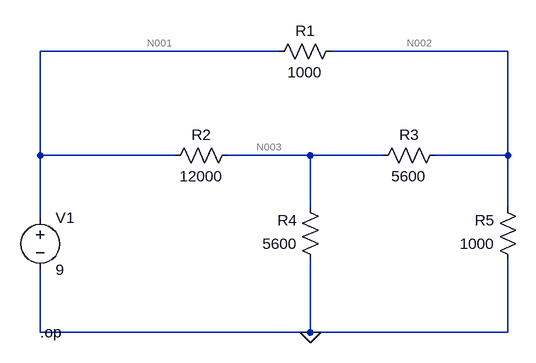
[diagram p0: schematic Circuit 1.asc]
Circuit 1.asc, the LTspice schematic file:
Version 4
SHEET 1 880 680
WIRE 160 80 -208 80
WIRE 512 80 240 80
WIRE -208 240 -208 80
WIRE 0 240 -208 240
WIRE 208 240 80 240
WIRE 320 240 208 240
WIRE 512 240 512 80
WIRE 512 240 400 240
WIRE 208 320 208 240
WIRE 512 320 512 240
WIRE -208 336 -208 240
WIRE -208 512 -208 416
WIRE 208 512 208 400
WIRE 208 512 -208 512
WIRE 512 512 512 400
WIRE 512 512 208 512
FLAG 208 512 0
SYMBOL res 256 64 R90
WINDOW 0 0 56 VBottom 2
WINDOW 3 32 56 VTop 2
SYMATTR InstName R1
SYMATTR Value 1000
SYMBOL res 96 224 R90
WINDOW 0 0 56 VBottom 2
WINDOW 3 32 56 VTop 2
SYMATTR InstName R2
SYMATTR Value 12000
SYMBOL res 224 416 R180
WINDOW 0 36 76 Left 2
WINDOW 3 36 40 Left 2
SYMATTR InstName R4
SYMATTR Value 5600
SYMBOL res 528 416 R180
WINDOW 0 36 76 Left 2
WINDOW 3 36 40 Left 2
SYMATTR InstName R5
SYMATTR Value 1000
SYMBOL voltage -208 320 R0
WINDOW 123 0 0 Left 0
WINDOW 39 0 0 Left 0
SYMATTR InstName V1
SYMATTR Value 9
SYMBOL res 416 224 R90
WINDOW 0 0 56 VBottom 2
WINDOW 3 32 56 VTop 2
SYMATTR InstName R3
SYMATTR Value 5600
TEXT -208 512 Left 2 !.op

The netlist it stands for:
* Circuit 1.asc
R1 N002 N001 1000
R2 N003 N001 12000
R4 0 N003 5600
R5 0 N002 1000
V1 N001 0 9
R3 N002 N003 5600
.op
.backanno
.end

* Results of the author's LTspice run, read from the files saved beside the schematic
* Operating Point:
*   V(n002) = 4.418 V
*   V(n001) = 9 V
*   V(n003) = 3.494 V
*   I(R1) = -4.582 mA
*   I(R2) = -458.9 µA
*   I(R4) = -623.9 µA
*   I(R5) = -4.418 mA
*   I(R3) = 165 µA
*   I(V1) = -5.041 mA